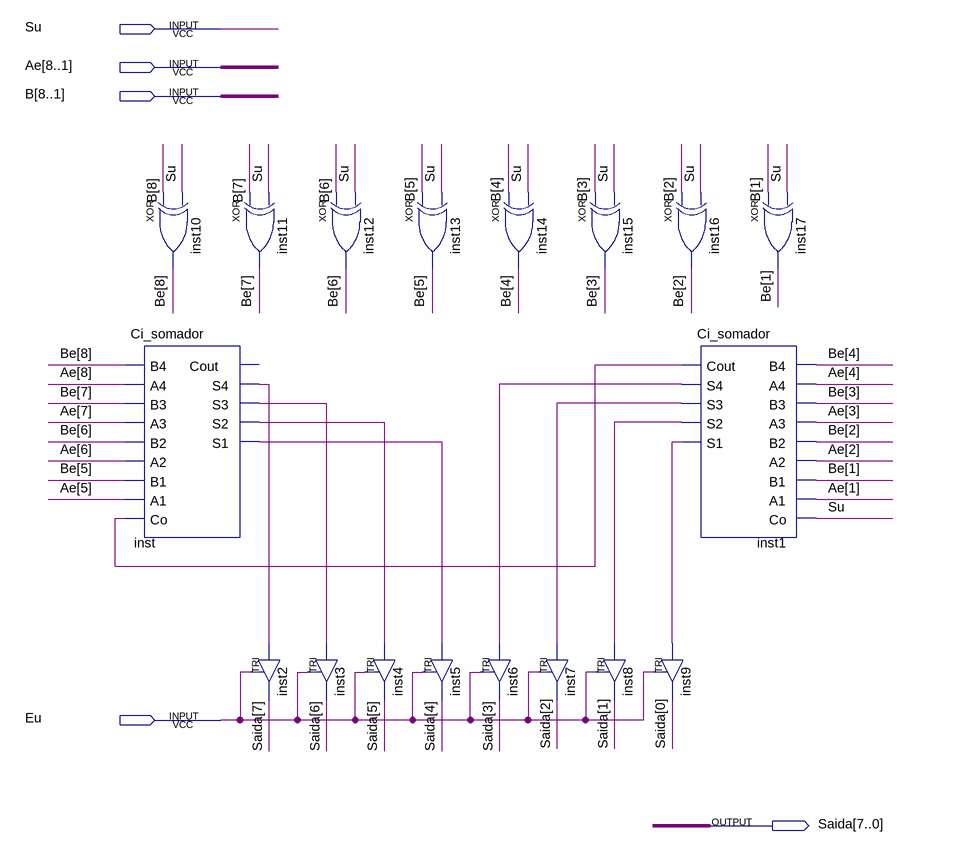
[diagram p0: schematic sheet]
// Quartus schematic Somador_Subtrator.bdf as structural Verilog: 18 symbols, 5 pins
module Somador_Subtrator (
  input  Su,
  input  [8:1] Ae,
  input  [8:1] B,
  input  Eu,
  output [7:0] Saida
);

  wire inst1_cout, inst1_s1, inst1_s2, inst1_s3, inst1_s4, inst_s1, inst_s2, inst_s3, inst_s4;
  wire [8:1] Be;

  xor inst10 (Be[8], B[8], Su);
  Ci_somador inst (
    .B4(Be[8]), .A4(Ae[8]), .B3(Be[7]), .A3(Ae[7]), .B2(Be[6]), .A2(Ae[6]), .B1(Be[5]), .A1(Ae[5]),
    .Co(inst1_cout), .S4(inst_s4), .S3(inst_s3), .S2(inst_s2), .S1(inst_s1));  // open: Cout
  xor inst11 (Be[7], B[7], Su);
  TRI inst2 (.IN(inst_s4), .OE(Eu), .OUT(Saida[7]));
  TRI inst3 (.IN(inst_s3), .OE(Eu), .OUT(Saida[6]));
  xor inst12 (Be[6], B[6], Su);
  TRI inst4 (.IN(inst_s2), .OE(Eu), .OUT(Saida[5]));
  xor inst13 (Be[5], B[5], Su);
  TRI inst5 (.IN(inst_s1), .OE(Eu), .OUT(Saida[4]));
  xor inst14 (Be[4], B[4], Su);
  TRI inst6 (.IN(inst1_s4), .OE(Eu), .OUT(Saida[3]));
  TRI inst7 (.IN(inst1_s3), .OE(Eu), .OUT(Saida[2]));
  xor inst15 (Be[3], B[3], Su);
  TRI inst8 (.IN(inst1_s2), .OE(Eu), .OUT(Saida[1]));
  xor inst16 (Be[2], B[2], Su);
  Ci_somador inst1 (
    .B4(Be[4]), .A4(Ae[4]), .B3(Be[3]), .A3(Ae[3]), .B2(Be[2]), .A2(Ae[2]), .B1(Be[1]), .A1(Ae[1]), .Co(Su),
    .Cout(inst1_cout), .S4(inst1_s4), .S3(inst1_s3), .S2(inst1_s2), .S1(inst1_s1));
  TRI inst9 (.IN(inst1_s1), .OE(Eu), .OUT(Saida[0]));
  xor inst17 (Be[1], B[1], Su);
endmodule
